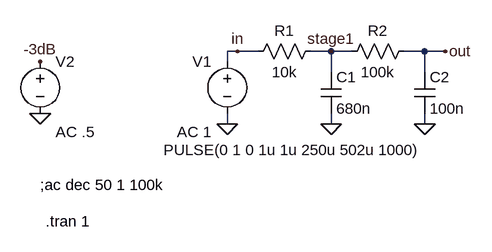
[diagram p0: schematic FilterSimulation.asc]
FilterSimulation.asc, the LTspice schematic file:
Version 4
SHEET 1 880 680
WIRE 80 176 64 176
WIRE 112 176 80 176
WIRE 224 176 192 176
WIRE 256 176 224 176
WIRE 368 176 336 176
WIRE 400 176 368 176
WIRE 64 192 64 176
WIRE 224 208 224 176
WIRE 368 208 368 176
WIRE 64 288 64 272
WIRE 224 288 224 272
WIRE 368 288 368 272
FLAG 224 288 0
FLAG 368 288 0
FLAG 64 288 0
FLAG 400 176 out
FLAG 224 176 stage1
FLAG 80 176 in
FLAG -224 272 0
FLAG -224 192 -3dB
SYMBOL res 96 192 R270
WINDOW 0 32 56 VTop 2
WINDOW 3 0 56 VBottom 2
SYMATTR InstName R1
SYMATTR Value 10k
SYMBOL res 240 192 R270
WINDOW 0 32 56 VTop 2
WINDOW 3 0 56 VBottom 2
SYMATTR InstName R2
SYMATTR Value 100k
SYMBOL cap 208 208 R0
SYMATTR InstName C1
SYMATTR Value 680n
SYMBOL cap 352 208 R0
SYMATTR InstName C2
SYMATTR Value 100n
SYMBOL voltage 64 176 M0
WINDOW 3 -300 152 Left 2
WINDOW 123 24 124 Left 2
WINDOW 39 0 0 Left 2
SYMATTR InstName V1
SYMATTR Value PULSE(0 1 0 1u 1u 250u 502u 1000)
SYMATTR Value2 AC 1
SYMBOL voltage -224 176 R0
WINDOW 123 24 124 Left 2
WINDOW 39 0 0 Left 2
SYMATTR InstName V2
SYMATTR Value ""
SYMATTR Value2 AC .5
TEXT -224 382 Left 2 !;ac dec 50 1 100k
TEXT -216 438 Left 2 !.tran 1

The netlist it stands for:
* FilterSimulation.asc
R1 in stage1 10k
R2 stage1 out 100k
C1 stage1 0 680n
C2 out 0 100n
V1 in 0 PULSE(0 1 0 1u 1u 250u 502u 1000) AC 1
V2 -3dB 0 AC .5
;ac dec 50 1 100k
.tran 1
.backanno
.end